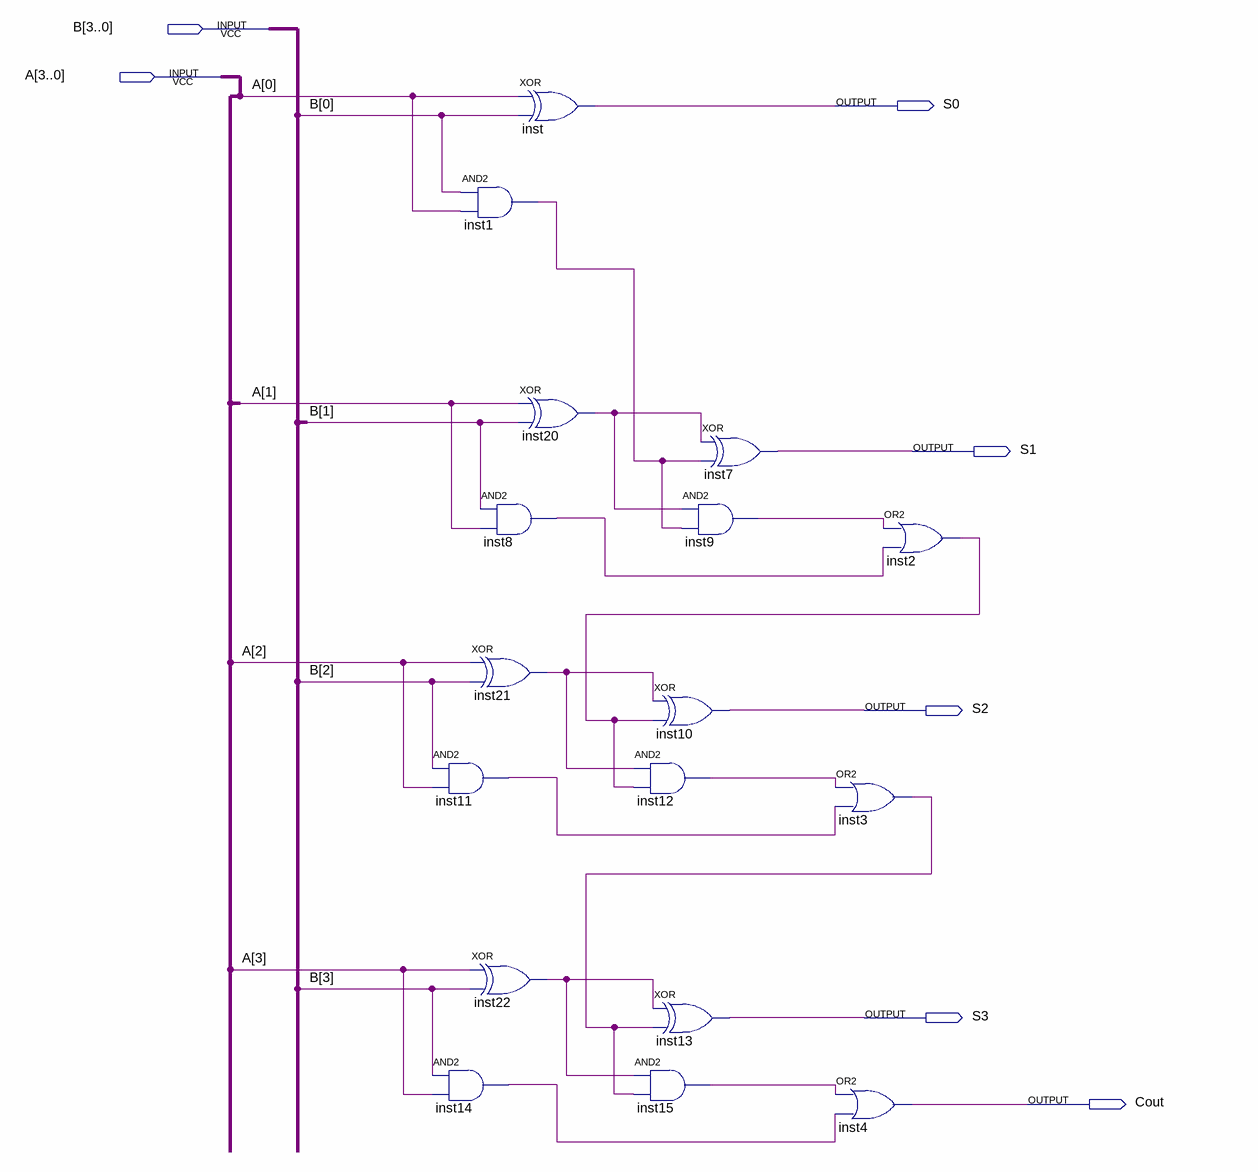
[diagram p0: schematic sheet]
// Quartus schematic Sum_4B.bdf as structural Verilog: 17 symbols, 7 pins
module Sum_4B (
  input  [3:0] B,
  input  [3:0] A,
  output S0,
  output S1,
  output S2,
  output S3,
  output Cout
);

  wire inst1_out, inst2_out, inst3_out, inst8_out, inst9_out, inst11_out, inst12_out, inst14_out, inst15_out,
       inst20_out, inst21_out, inst22_out;

  and inst1 (inst1_out, B[0], A[0]);
  and inst11 (inst11_out, B[2], A[2]);
  and inst14 (inst14_out, B[3], A[3]);
  xor inst (S0, A[0], B[0]);
  xor inst20 (inst20_out, A[1], B[1]);
  and inst8 (inst8_out, B[1], A[1]);
  xor inst21 (inst21_out, A[2], B[2]);
  xor inst22 (inst22_out, A[3], B[3]);
  and inst9 (inst9_out, inst20_out, inst1_out);
  xor inst10 (S2, inst21_out, inst2_out);
  and inst12 (inst12_out, inst21_out, inst2_out);
  xor inst13 (S3, inst22_out, inst3_out);
  and inst15 (inst15_out, inst22_out, inst3_out);
  xor inst7 (S1, inst20_out, inst1_out);
  or inst3 (inst3_out, inst12_out, inst11_out);
  or inst4 (Cout, inst15_out, inst14_out);
  or inst2 (inst2_out, inst9_out, inst8_out);
endmodule
